# EAGLE design MotorController (EAGLE 9.6.2)

## Sheet 1 of 3
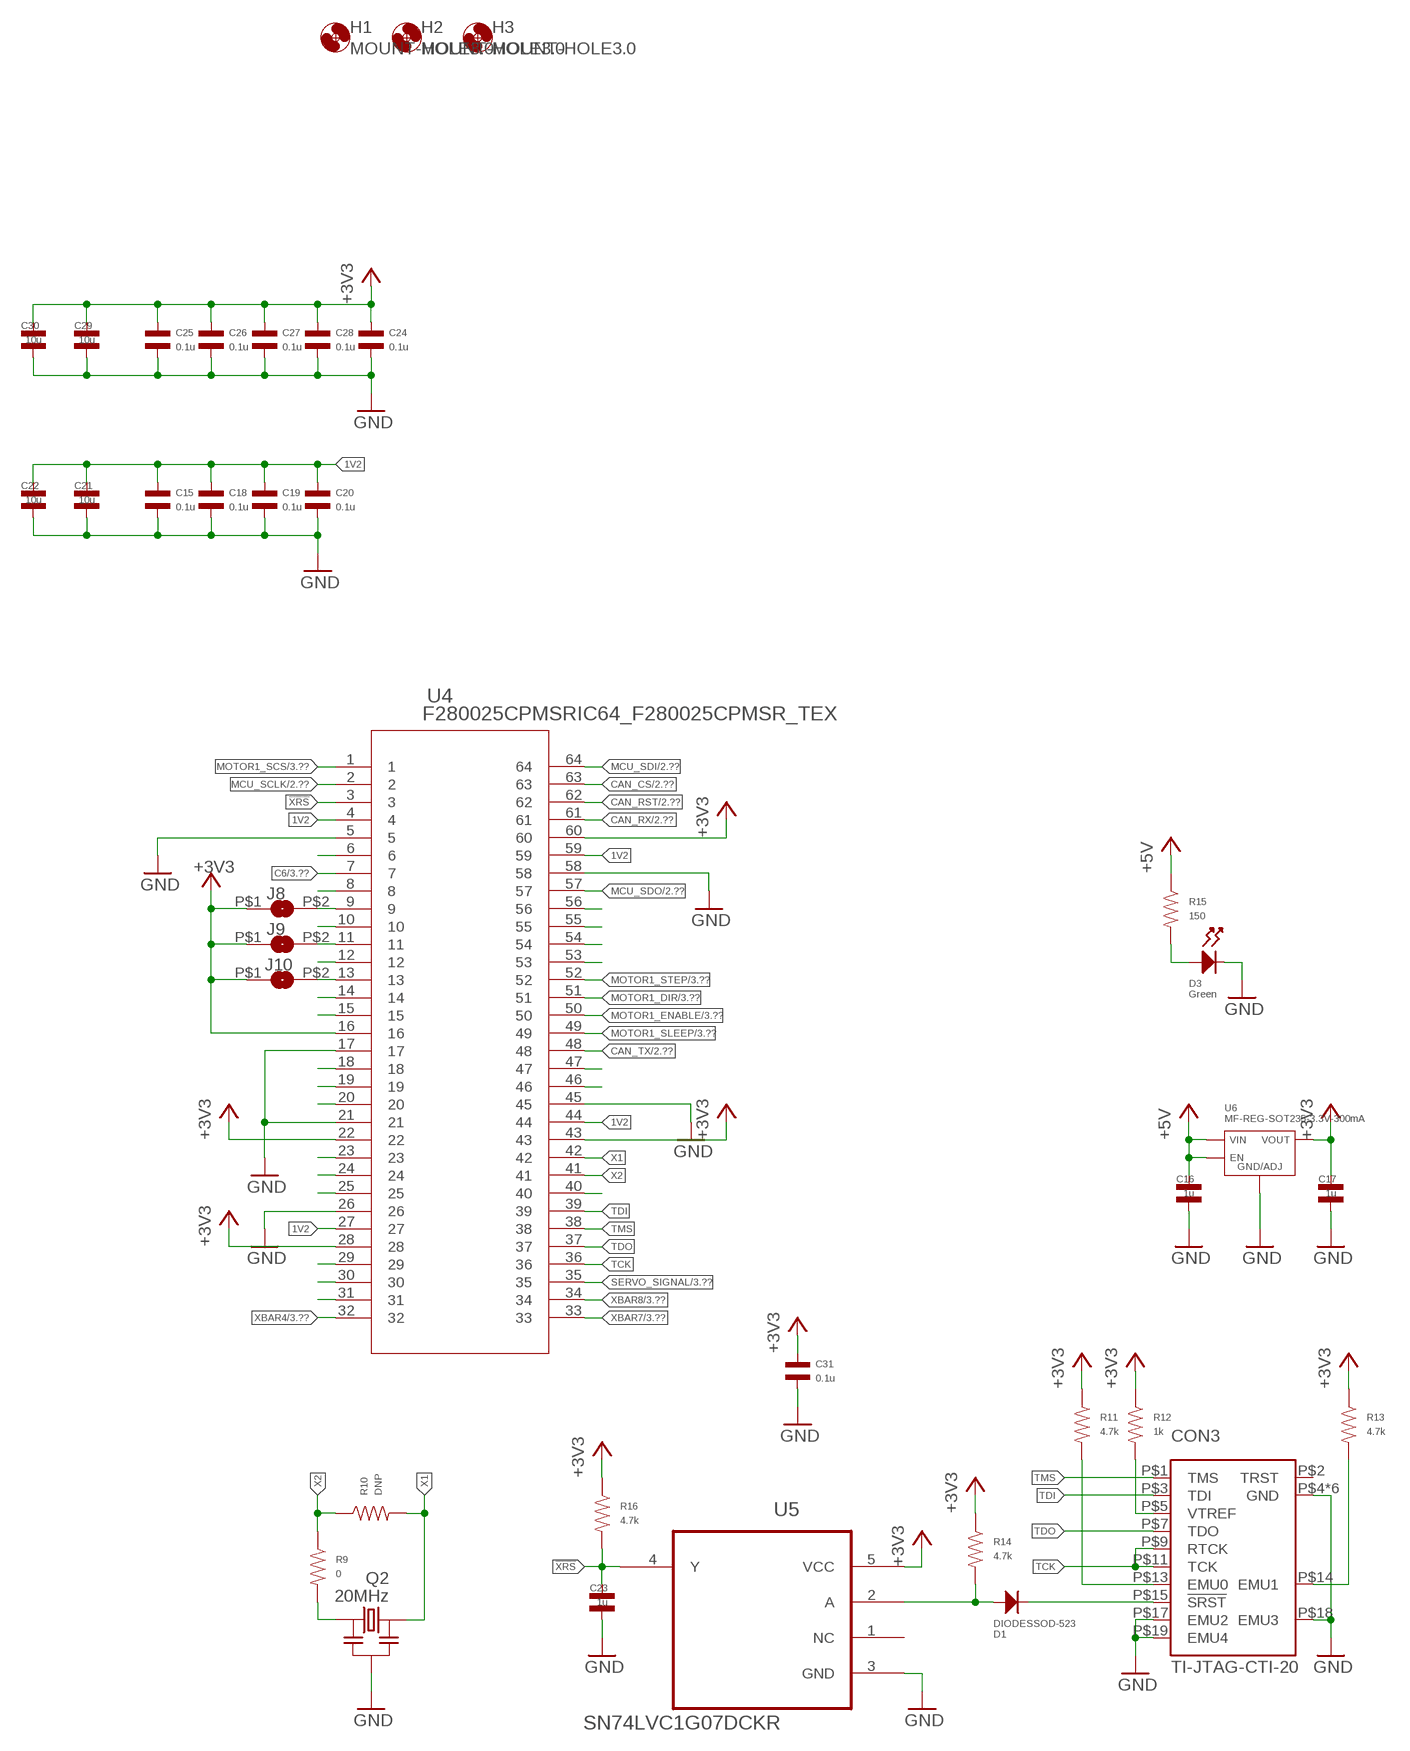
[diagram p0: schematic, sheet 1]

### Parts
C15  0.1u  CAPACITOR_NP_0402  [C0402]
C16  1u  CAPACITOR_NP_0805  [C0805]
C17  1u  CAPACITOR_NP_0805  [C0805]
C18  0.1u  CAPACITOR_NP_0402  [C0402]
C19  0.1u  CAPACITOR_NP_0402  [C0402]
C20  0.1u  CAPACITOR_NP_0402  [C0402]
C21  10u  CAPACITOR_NP_0805  [C0805]
C22  10u  CAPACITOR_NP_0805  [C0805]
C23  1u  CAPACITOR_NP_0402  [C0402]
C24  0.1u  CAPACITOR_NP_0402  [C0402]
C25  0.1u  CAPACITOR_NP_0402  [C0402]
C26  0.1u  CAPACITOR_NP_0402  [C0402]
C27  0.1u  CAPACITOR_NP_0402  [C0402]
C28  0.1u  CAPACITOR_NP_0402  [C0402]
C29  10u  CAPACITOR_NP_0805  [C0805]
C30  10u  CAPACITOR_NP_0805  [C0805]
C31  0.1u  CAPACITOR_NP_0402  [C0402]
CON3  TI-JTAG-CTI-20  [FTR-110-51-L-D-06]
D1  DIODESSOD-523  [SOD523]
D3  Green  LED_SINGLE-0603  [LED0603]
H1  MOUNT-HOLE3.0  [3,0]
H2  MOUNT-HOLE3.0  [3,0]
H3  MOUNT-HOLE3.0  [3,0]
J8  JUMPER  [SJ]
J9  JUMPER  [SJ]
J10  JUMPER  [SJ]
Q2  20MHz  RESONATORCSTNE  [CSTNE]
R9  0  RESISTOR_0402  [R0402]
R10  DNP  RESISTOR_0402  [R0402]
R11  4.7k  RESISTOR_0402  [R0402]
R12  1k  RESISTOR_0402  [R0402]
R13  4.7k  RESISTOR_0402  [R0402]
R14  4.7k  RESISTOR_0402  [R0402]
R15  150  RESISTOR_0805  [R0805]
R16  4.7k  RESISTOR_0402  [R0402]
U4  F280025CPMSRIC64_F280025CPMSR_TEX  [IC64_F280025CPMSR_TEX]
U5  SN74LVC1G07DCKR  [SOT65P210X110-5N]
U6  MF-REG-SOT235-3.3V-300mA  TLV70233PDBVR  [SOT-23-5]

### Nets
1V2: C15.P$1 C18.P$1 C19.P$1 C20.P$1 C21.P$1 C22.P$1 U4.4 U4.27 U4.44 U4.59
!XRS: C23.P$1 R16.P$2 U4.3 U5.4(Y)
+3V3: C17.P$1 C24.P$1 C25.P$1 C26.P$1 C27.P$1 C28.P$1 C29.P$1 C30.P$1 C31.P$1 J8.P$1 J9.P$1 J10.P$1 R11.P$1 R12.P$1 R13.P$1 R14.P$1 R16.P$1 U4.16 U4.22 U4.28 U4.43 U4.60 U5.5(VCC) U6.P$5(VOUT) ; also sheet 2,3
+5V: C16.P$1 R15.P$1 U6.P$1(VIN) U6.P$3(EN) ; also sheet 2,3
C6: U4.7 ; also sheet 3
CAN_CS: U4.63 ; also sheet 2
CAN_RST: U4.62 ; also sheet 2
CAN_RX: U4.61 ; also sheet 2
CAN_TX: U4.48 ; also sheet 2
GND: C15.P$2 C16.P$2 C17.P$2 C18.P$2 C19.P$2 C20.P$2 C21.P$2 C22.P$2 C23.P$2 C24.P$2 C25.P$2 C26.P$2 C27.P$2 C28.P$2 C29.P$2 C30.P$2 C31.P$2 CON3.P$4(GND) CON3.P$8(GND) CON3.P$10(GND) CON3.P$12(GND) CON3.P$16(GND) CON3.P$17(EMU2) CON3.P$18(EMU3) CON3.P$19(EMU4) CON3.P$20(GND) D3.CATHODE Q2.2(GND) U4.5 U4.17 U4.21 U4.26 U4.45 U4.58 U5.3(GND) U6.P$2(GND/ADJ) ; also sheet 2,3
MCU_SCLK: U4.2 ; also sheet 2,3
MCU_SDI: U4.64 ; also sheet 2,3
MCU_SDO: U4.57 ; also sheet 2,3
MOTOR1_DIR: U4.51 ; also sheet 3
MOTOR1_ENABLE: U4.50 ; also sheet 3
MOTOR1_SCS: U4.1 ; also sheet 3
MOTOR1_SLEEP: U4.49 ; also sheet 3
MOTOR1_STEP: U4.52 ; also sheet 3
N$1: D3.ANODE R15.P$2
N$2: U4.18
N$3: U4.19
N$5: CON3.P$5(VTREF) R12.P$2
N$6: Q2.3(XOUT) R9.P$2
N$7: U4.23
N$8: U4.24
N$9: U4.25
N$10: CON3.P$13(EMU0) R11.P$2
N$11: CON3.P$14(EMU1) R13.P$2
N$12: CON3.P$15(!SRST) D1.C(CATHODE)
N$13: U4.29
N$14: U4.30
N$15: U4.31
N$22: U4.20
N$24: U4.40
N$25: D1.A(ANODE) R14.P$2 U5.2(A)
N$26: U4.53
N$27: J8.P$2 U4.9
N$29: U4.10
N$30: U4.46
N$31: U4.47
N$32: J9.P$2 U4.11
N$33: U4.12
N$34: J10.P$2 U4.13
N$35: U4.14
N$36: U4.15
N$38: U4.6
N$40: U4.8
N$54: U4.54
N$55: U4.55
N$56: U4.56
SERVO_SIGNAL: U4.35 ; also sheet 3
TCK: CON3.P$9(RTCK) CON3.P$11(TCK) U4.36
TDI: CON3.P$3(TDI) U4.39
TDO: CON3.P$7(TDO) U4.37
TMS: CON3.P$1(TMS) U4.38
X1: Q2.1(XIN) R10.P$2 U4.42
X2: R9.P$1 R10.P$1 U4.41
XBAR4: U4.32 ; also sheet 3
XBAR7: U4.33 ; also sheet 3
XBAR8: U4.34 ; also sheet 3
Unconnected: CON3.P$2(TRST) U5.1(NC)

## Sheet 2 of 3
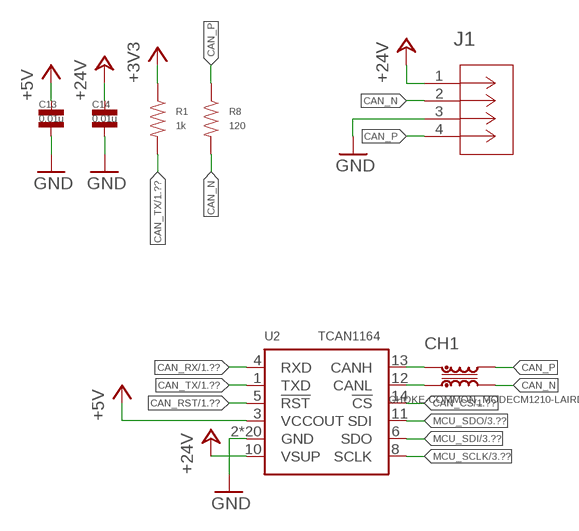
[diagram p1: schematic, sheet 2]

### Parts
C13  0.01u  CAPACITOR_NP_0402  [C0402]
C14  0.01u  CAPACITOR_NP_0402  [C0402]
CH1  CHOKE-COMMON_MODECM1210-LAIRD  [CM1210-LAIRD]
J1  768250004CON_768250004_MOL  [CON_768250004_MOL]
R1  1k  RESISTOR_0402  [R0402]
R8  120  RESISTOR_0402  [R0402]
U2  TCAN1164  [CONV_TPS63021DSJ]

### Nets
+3V3: R1.P$1 ; also sheet 1,3
+5V: C13.P$1 U2.3(VCCOUT) ; also sheet 1,3
+24V: C14.P$1 J1.1 U2.10(VSUP) ; also sheet 3
CAN_CS: U2.14(!CS) ; also sheet 1
CAN_N: CH1.P$3 J1.2 R8.P$2
CAN_P: CH1.P$2 J1.4 R8.P$1
CAN_RST: U2.5(!RST) ; also sheet 1
CAN_RX: U2.4(RXD) ; also sheet 1
CAN_TX: R1.P$2 U2.1(TXD) ; also sheet 1
GND: C13.P$2 C14.P$2 J1.3 U2.2(GND) U2.15(GND) U2.15_1(GND) U2.15_2(GND) U2.15_3(GND) U2.15_4(GND) U2.15_5(GND) U2.15_6(GND) U2.15_7(GND) U2.15_8(GND) U2.15_9(GND) U2.15_10(GND) U2.15_11(GND) U2.15_12(GND) U2.15_15(GND) U2.15_16(GND) U2.15_17(GND) U2.15_21(GND) U2.15_22(GND) U2.15_23(GND) ; also sheet 1,3
MCU_SCLK: U2.8(SCLK) ; also sheet 1,3
MCU_SDI: U2.6(SDO) ; also sheet 1,3
MCU_SDO: U2.11(SDI) ; also sheet 1,3
N$4: CH1.P$4 U2.12(CANL)
N$17: CH1.P$1 U2.13(CANH)

## Sheet 3 of 3
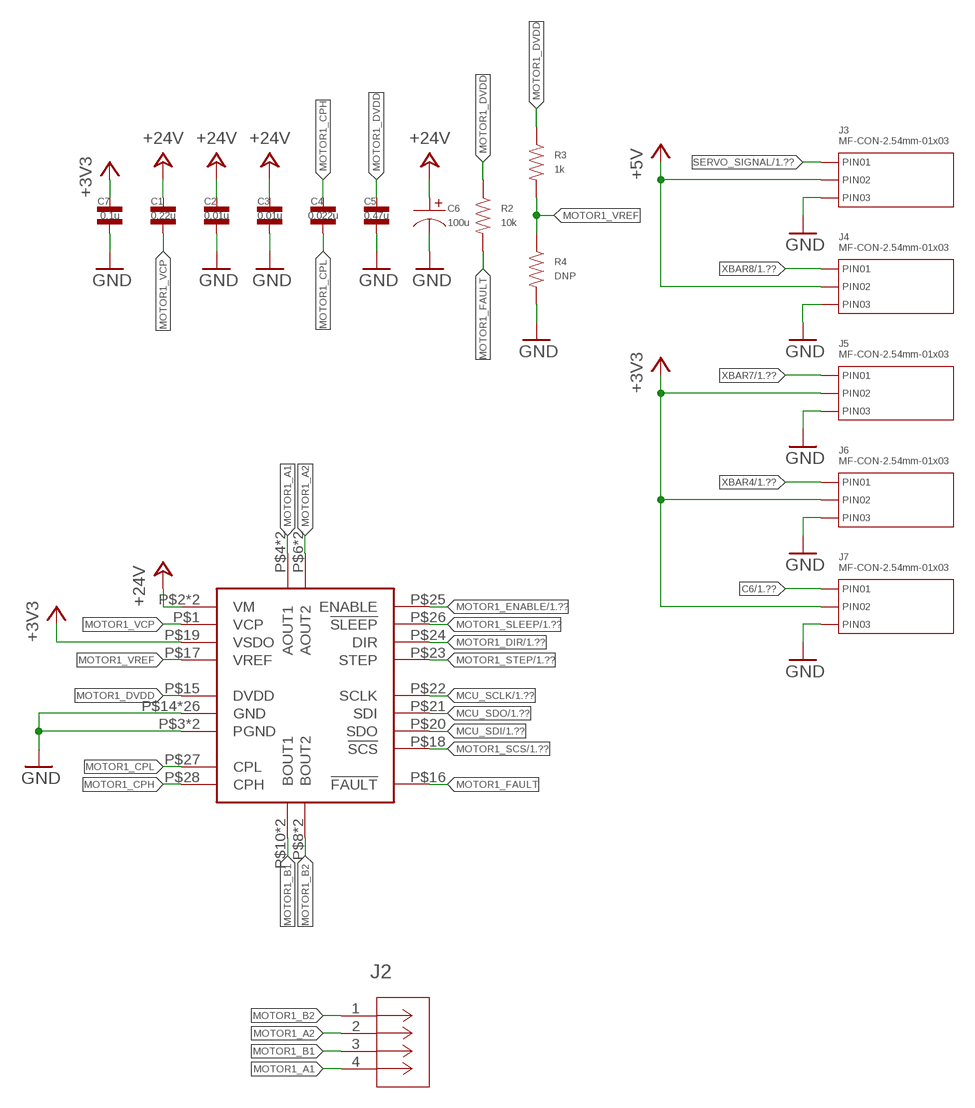
[diagram p2: schematic, sheet 3]

### Parts
C1  0.22u  CAPACITOR_NP_0402  [C0402]
C2  0.01u  CAPACITOR_NP_0402  [C0402]
C3  0.01u  CAPACITOR_NP_0402  [C0402]
C4  0.022u  CAPACITOR_NP_0402  [C0402]
C5  0.47u  CAPACITOR_NP_0402  [C0402]
C6  100u  CAPACITOR_P_6.3MM  [CP6.3MM]
C7  0.1u  CAPACITOR_NP_0402  [C0402]
J2  768250004CON_768250004_MOL  [CON_768250004_MOL]
J3  MF-CON-2.54mm-01x03  CON_01X03_PTH_2.54MM  [PTH_2.54MM_01X03]
J4  MF-CON-2.54mm-01x03  CON_01X03_PTH_2.54MM  [PTH_2.54MM_01X03]
J5  MF-CON-2.54mm-01x03  CON_01X03_PTH_2.54MM  [PTH_2.54MM_01X03]
J6  MF-CON-2.54mm-01x03  CON_01X03_PTH_2.54MM  [PTH_2.54MM_01X03]
J7  MF-CON-2.54mm-01x03  CON_01X03_PTH_2.54MM  [PTH_2.54MM_01X03]
R2  10k  RESISTOR_0402  [R0402]
R3  1k  RESISTOR_0402  [R0402]
R4  DNP  RESISTOR_0402  [R0402]
U1  DRV8434SPWPR  [HTSSOP(PWP)-28]

### Nets
+3V3: C7.P$1 J5.P$2(PIN2) J6.P$2(PIN2) J7.P$2(PIN2) U1.P$19(VSDO) ; also sheet 1,2
+5V: J3.P$2(PIN2) J4.P$2(PIN2) ; also sheet 1,2
+24V: C1.P$1 C2.P$1 C3.P$1 C6.P$1 U1.P$2(VM) U1.P$13(VM) ; also sheet 2
C6: J7.P$1(PIN1) ; also sheet 1
GND: C2.P$2 C3.P$2 C5.P$2 C6.P$2 C7.P$2 J3.P$3(PIN3) J4.P$3(PIN3) J5.P$3(PIN3) J6.P$3(PIN3) J7.P$3(PIN3) R4.P$2 U1.P$3(PGND) U1.P$12(PGND) U1.P$14(GND) U1.P$29(GND) U1.P$30(GND) U1.P$31(GND) U1.P$32(GND) U1.P$33(GND) U1.P$34(GND) U1.P$35(GND) U1.P$36(GND) U1.P$37(GND) U1.P$38(GND) U1.P$39(GND) U1.P$40(GND) U1.P$41(GND) U1.P$42(GND) U1.P$43(GND) U1.P$44(GND) U1.P$45(GND) U1.P$46(GND) U1.P$47(GND) U1.P$48(GND) U1.P$49(GND) U1.P$50(GND) U1.P$51(GND) U1.P$52(GND) U1.P$53(GND) ; also sheet 1,2
MCU_SCLK: U1.P$22(SCLK) ; also sheet 1,2
MCU_SDI: U1.P$20(SDO) ; also sheet 1,2
MCU_SDO: U1.P$21(SDI) ; also sheet 1,2
MOTOR1_A1: J2.4 U1.P$4(AOUT1) U1.P$5(AOUT1)
MOTOR1_A2: J2.2 U1.P$6(AOUT2) U1.P$7(AOUT2)
MOTOR1_B1: J2.3 U1.P$10(BOUT1) U1.P$11(BOUT1)
MOTOR1_B2: J2.1 U1.P$8(BOUT2) U1.P$9(BOUT2)
MOTOR1_CPH: C4.P$1 U1.P$28(CPH)
MOTOR1_CPL: C4.P$2 U1.P$27(CPL)
MOTOR1_DIR: U1.P$24(DIR) ; also sheet 1
MOTOR1_DVDD: C5.P$1 R2.P$1 R3.P$1 U1.P$15(DVDD)
MOTOR1_ENABLE: U1.P$25(ENABLE) ; also sheet 1
MOTOR1_FAULT: R2.P$2 U1.P$16(!FAULT)
MOTOR1_SCS: U1.P$18(!SCS) ; also sheet 1
MOTOR1_SLEEP: U1.P$26(!SLEEP) ; also sheet 1
MOTOR1_STEP: U1.P$23(STEP) ; also sheet 1
MOTOR1_VCP: C1.P$2 U1.P$1(VCP)
MOTOR1_VREF: R3.P$2 R4.P$1 U1.P$17(VREF)
SERVO_SIGNAL: J3.P$1(PIN1) ; also sheet 1
XBAR4: J6.P$1(PIN1) ; also sheet 1
XBAR7: J5.P$1(PIN1) ; also sheet 1
XBAR8: J4.P$1(PIN1) ; also sheet 1

## Library data of the parts
C1 = MF_Passives:CAPACITOR_NP: Library: MF_Passives Description: Device for Non-Polarized Capacitors. Manufacture part number (MPN) can be added via Attributes. Check https://factory.macrofab.com/parts for the house parts list.; MPN: CL05B224KA5VPNC; POPULATE: 1
C2 C3 C13 C14 = MF_Passives:CAPACITOR_NP: Library: MF_Passives Description: Device for Non-Polarized Capacitors. Manufacture part number (MPN) can be added via Attributes. Check https://factory.macrofab.com/parts for the house parts list.; MPN: CL05B103KB5NNNC; POPULATE: 1
C4 = MF_Passives:CAPACITOR_NP: Library: MF_Passives Description: Device for Non-Polarized Capacitors. Manufacture part number (MPN) can be added via Attributes. Check https://factory.macrofab.com/parts for the house parts list.; MPN: CL05B223KB5VPNC; POPULATE: 1
C5 = MF_Passives:CAPACITOR_NP: Library: MF_Passives Description: Device for Non-Polarized Capacitors. Manufacture part number (MPN) can be added via Attributes. Check https://factory.macrofab.com/parts for the house parts list.; MPN: CL05A474KA5NNNC; POPULATE: 1
C6 = MF_Passives:CAPACITOR_P: Library: MF_Passives Description: Device for Polarized Capacitors. Manufacture part number (MPN), Voltage Rating, and Tolerance can be added via Attributes. Check https://factory.macrofab.com/parts for the house parts list.; MPN: MAL218297603E3; POPULATE: 1
C7 C15 C18-C20 C24-C28 C31 = MF_Passives:CAPACITOR_NP: Library: MF_Passives Description: Device for Non-Polarized Capacitors. Manufacture part number (MPN) can be added via Attributes. Check https://factory.macrofab.com/parts for the house parts list.; MPN: GCM155R71H104KE02D; POPULATE: 1
C16 C17 = MF_Passives:CAPACITOR_NP: Library: MF_Passives Description: Device for Non-Polarized Capacitors. Manufacture part number (MPN) can be added via Attributes. Check https://factory.macrofab.com/parts for the house parts list.; MPN: CL21B105KAFNNNE; POPULATE: 1
C21 C22 C29 C30 = MF_Passives:CAPACITOR_NP: Library: MF_Passives Description: Device for Non-Polarized Capacitors. Manufacture part number (MPN) can be added via Attributes. Check https://factory.macrofab.com/parts for the house parts list.; MPN: CL21A106KAYNNNE; POPULATE: 1
C23 = MF_Passives:CAPACITOR_NP: Library: MF_Passives Description: Device for Non-Polarized Capacitors. Manufacture part number (MPN) can be added via Attributes. Check https://factory.macrofab.com/parts for the house parts list.; MPN: CL05A105KA5NQNC; POPULATE: 1
CH1 = vehicle-control:CHOKE-COMMON_MODE; MPN: CM1210B104R-1A
CON3 = vehicle-control:TI-JTAG-CTI-20; MPN: FTR-110-51-L-D-06
D1 = MF_Discrete_Semiconductor:DIODES: Library: MF_Discrete_Semiconductor Description: Device for Single Packaged Diodes.; MPN: RB510SM-40FHT2R
D3 = MF_LEDs:LED_SINGLE: Library: MF_LEDs Description: Device for Single LED Packages. Manufacture part number (MFG#) can be added via Attributes.; HOUSEPART: NO; MPN: SML-E12P8WT86; POPULATE: 1
H1-H3 = holes:MOUNT-HOLE: MOUNTING HOLE with drill center marker
J1 J2 = Molex0768250004:768250004; COPYRIGHT: Copyright (C) 2024 Ultra Librarian. All rights reserved.; MANUFACTURER_PART_NUMBER: 768250004; MFR_NAME: Molex Connector Corporation; MPN: 0768250004
J3-J7 = MF_Connectors:CON_01X03: Library: MF_Connectors Description: Header Connector with 03 Positions and 01 Rows. Use the LABEL Attribute to label the pin on the schematic and PCB. You can remove the attributes on the PCB by using the SMASH function on the part and then deleting the text.; HOUSEPART: YES; MPN: MF-CON-2.54mm-01x03; POPULATE: 1; URL: https://factory.macrofab.com/part/MF-CON-2.54mm-01x03
J8-J10 = MF_Connectors:JUMPER
Q2 = vehicle-control:RESONATOR; MPN: CSTNE20M0V53C000R0
R1 R3 R12 = MF_Passives:RESISTOR: Library: MF_Passives Description: Device for Resistors. Manufacture part number (MPN), Voltage, Tolerance, and Wattage Rating can be added via Attributes. Check https://factory.macrofab.com/parts for the house parts list.; MPN: ERJ-2RKF1001X; POPULATE: 1
R2 = MF_Passives:RESISTOR: Library: MF_Passives Description: Device for Resistors. Manufacture part number (MPN), Voltage, Tolerance, and Wattage Rating can be added via Attributes. Check https://factory.macrofab.com/parts for the house parts list.; MPN: ERJ-2RKF1002X; POPULATE: 1
R4 R10 = MF_Passives:RESISTOR: Library: MF_Passives Description: Device for Resistors. Manufacture part number (MPN), Voltage, Tolerance, and Wattage Rating can be added via Attributes. Check https://factory.macrofab.com/parts for the house parts list.; POPULATE: 1
R8 = MF_Passives:RESISTOR: Library: MF_Passives Description: Device for Resistors. Manufacture part number (MPN), Voltage, Tolerance, and Wattage Rating can be added via Attributes. Check https://factory.macrofab.com/parts for the house parts list.; MPN: ERJ-2GEJ121X; POPULATE: 1
R9 = MF_Passives:RESISTOR: Library: MF_Passives Description: Device for Resistors. Manufacture part number (MPN), Voltage, Tolerance, and Wattage Rating can be added via Attributes. Check https://factory.macrofab.com/parts for the house parts list.; MPN: ERJ-2GE0R00X; POPULATE: 1
R11 R13 R14 R16 = MF_Passives:RESISTOR: Library: MF_Passives Description: Device for Resistors. Manufacture part number (MPN), Voltage, Tolerance, and Wattage Rating can be added via Attributes. Check https://factory.macrofab.com/parts for the house parts list.; MPN: ERJ-2RKF4701X; POPULATE: 1
R15 = MF_Passives:RESISTOR: Library: MF_Passives Description: Device for Resistors. Manufacture part number (MPN), Voltage, Tolerance, and Wattage Rating can be added via Attributes. Check https://factory.macrofab.com/parts for the house parts list.; MPN: ERJ-6GEYJ151V; POPULATE: 1
U1 = TI DRV:DRV8434SPWPR; MPN: DRV8434SPWPR
U2 = TCAN1043GDMTRQ1:TCAN1164; MPN: TCAN1164DMTRQ1
U4 = F280025CPMSR:F280025CPMSR; COPYRIGHT: Copyright (C) 2024 Ultra Librarian. All rights reserved.; MANUFACTURER_PART_NUMBER: F280025CPMSR; MFR_NAME: Texas Instruments; MPN: F280025CPMSR
U5 = Texas Instruments_By_element14_Batch_1:SN74LVC1G07DCKR: SINGLE BUFFER/DRIVER WITH OPEN-DRAIN OUTPUT; MPN: SN74LVC1G07DCKR; OC_FARNELL: 1287544; OC_NEWARK: 76C4075; PACKAGE: SC70-5; SUPPLIER: Texas Instruments
U6 = MF_IC_Power:TLV702: Manufacturer Part #: TLV702 Manufacturer: Texas Instruments Description: LDO Voltage Regulators; HOUSEPART: YES; MPN: TLV70233PDBVR; POPULATE: 1; URL: https://factory.macrofab.com/part/MF-REG-SOT235-3.3V-300mA

## Board
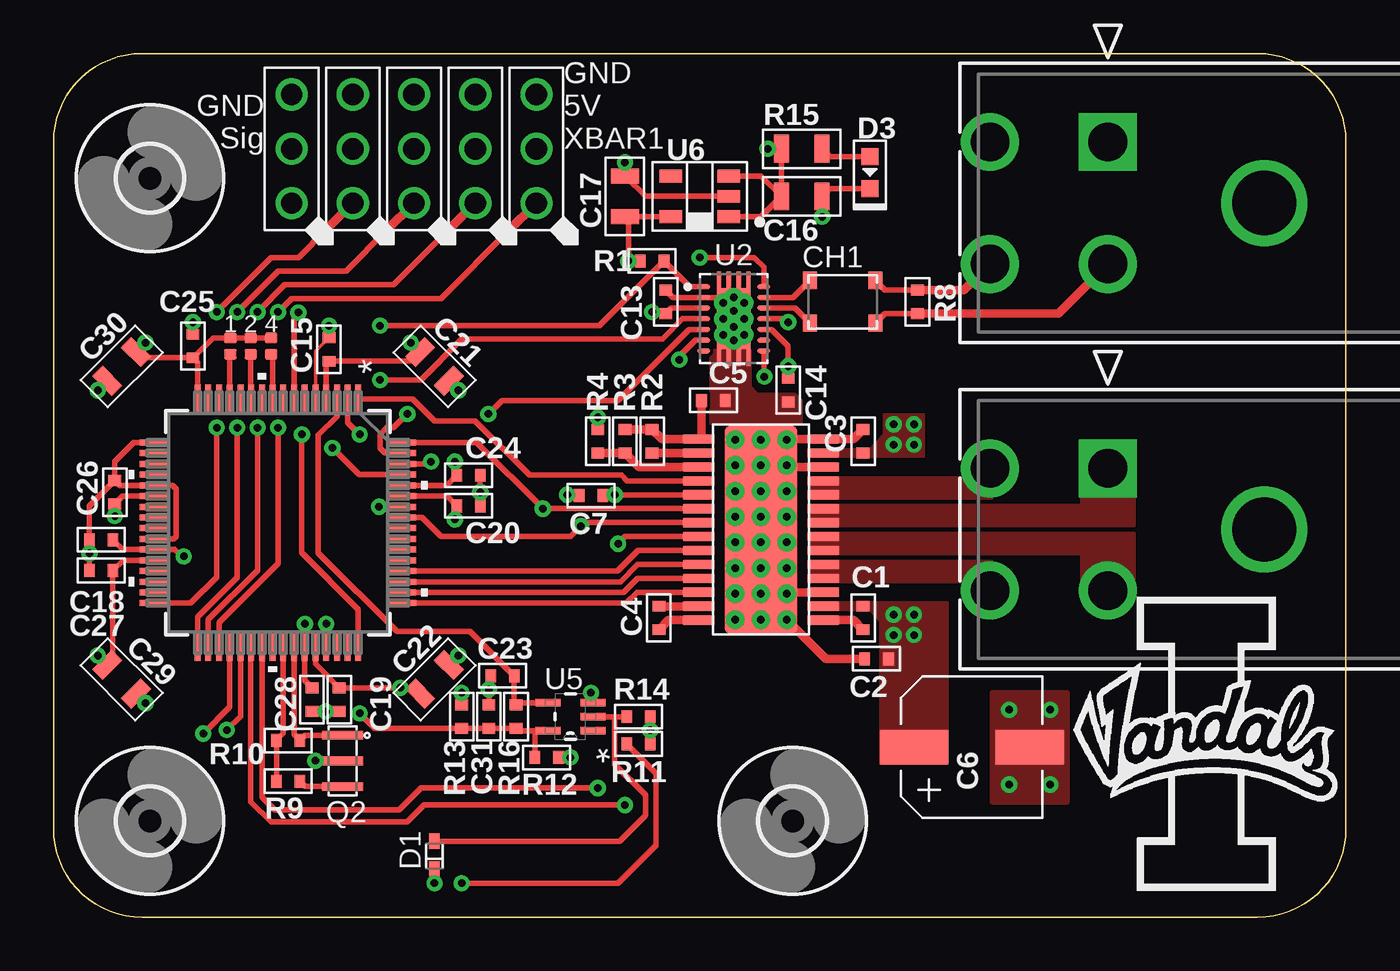
[diagram p3: board, top side]
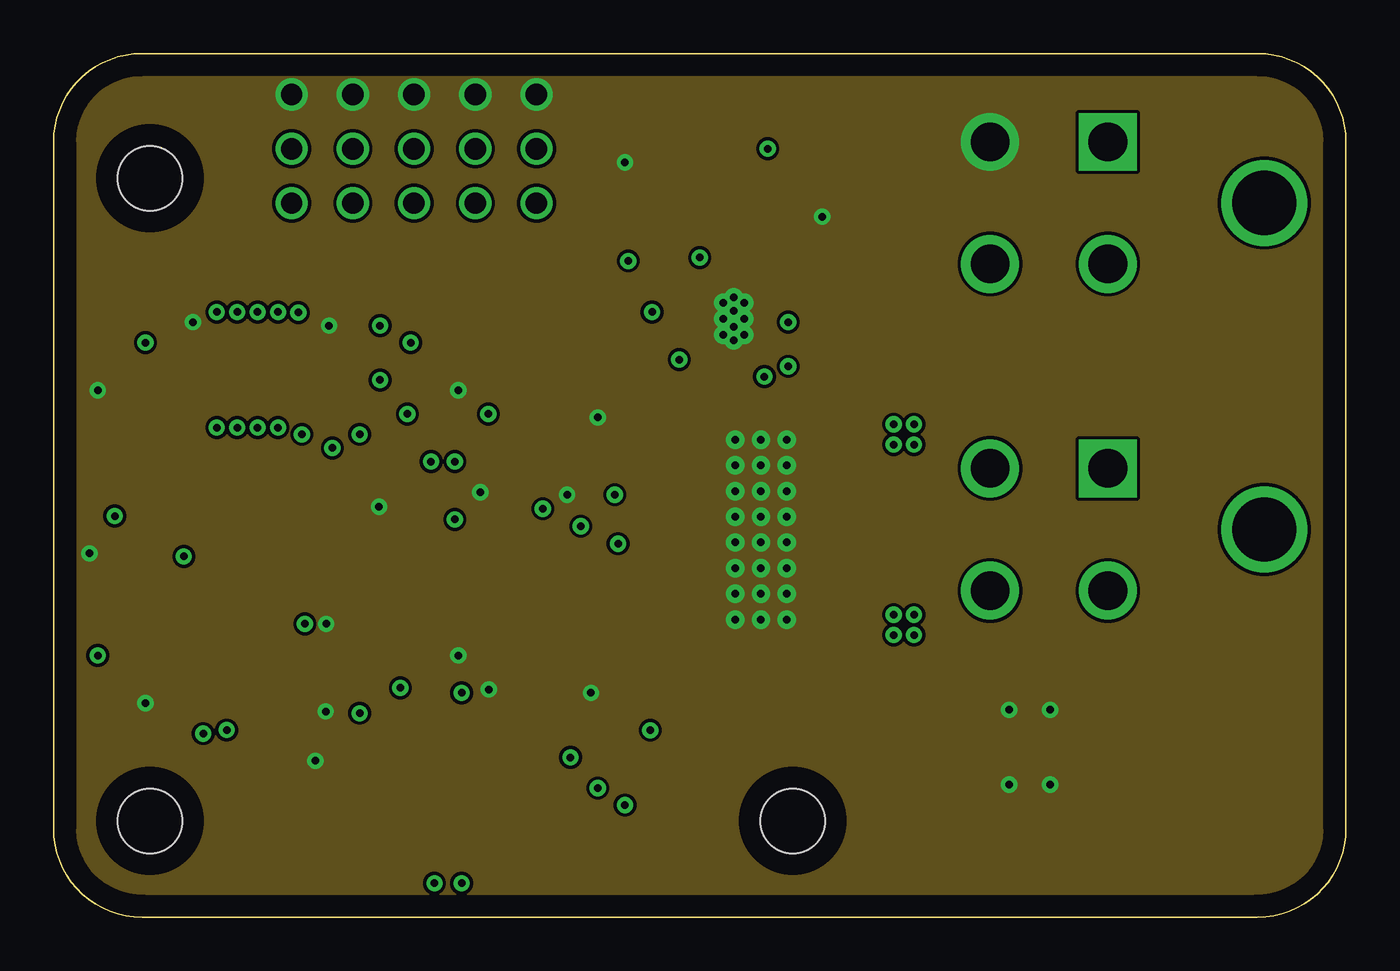
[diagram p4: board, inner layer GND]
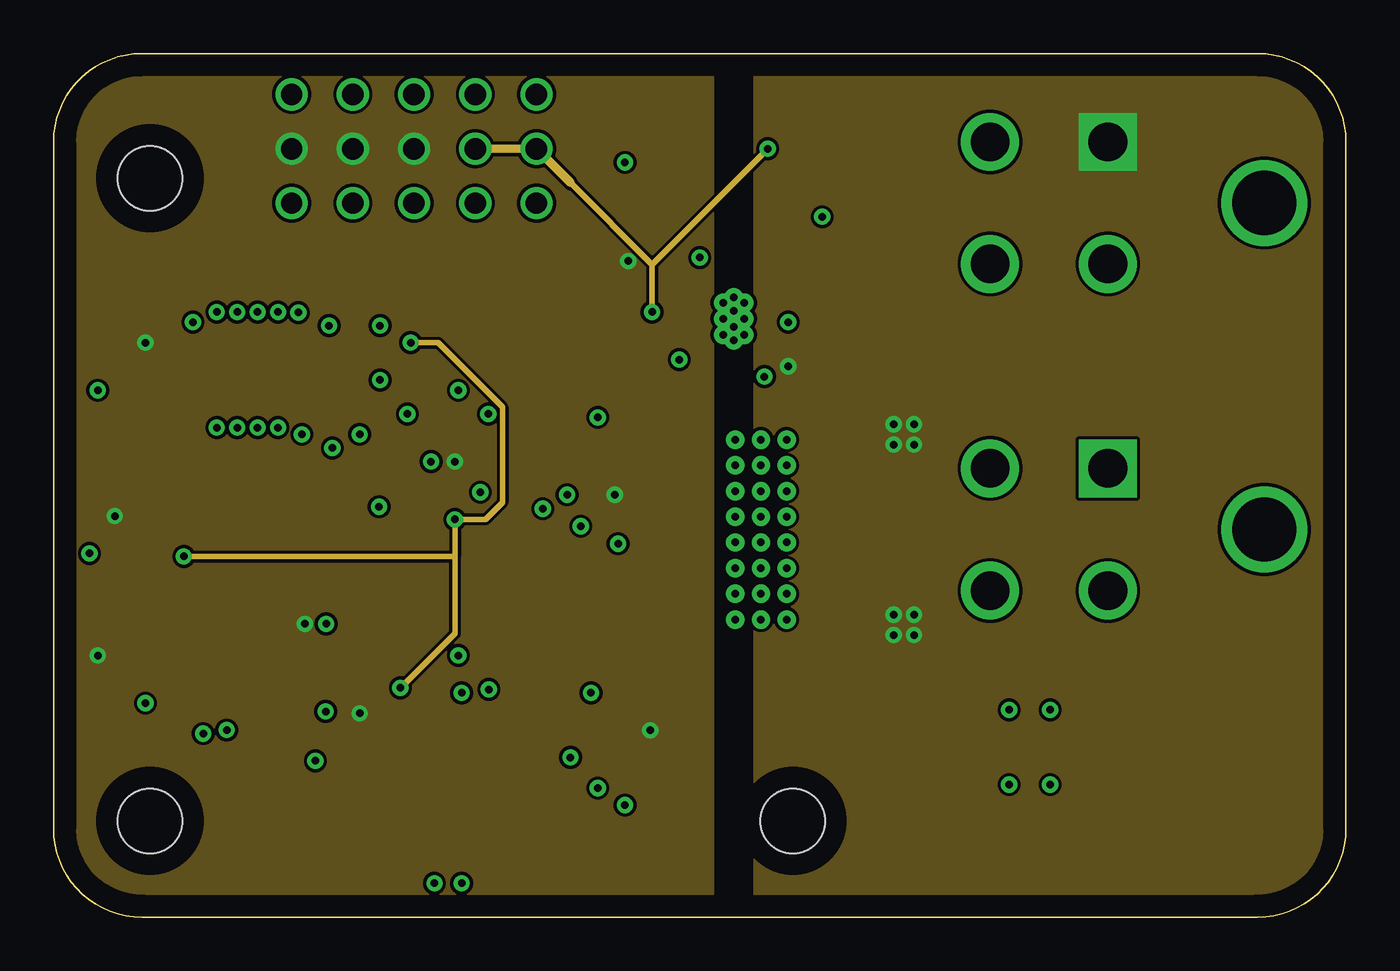
[diagram p5: board, inner layer PWR]
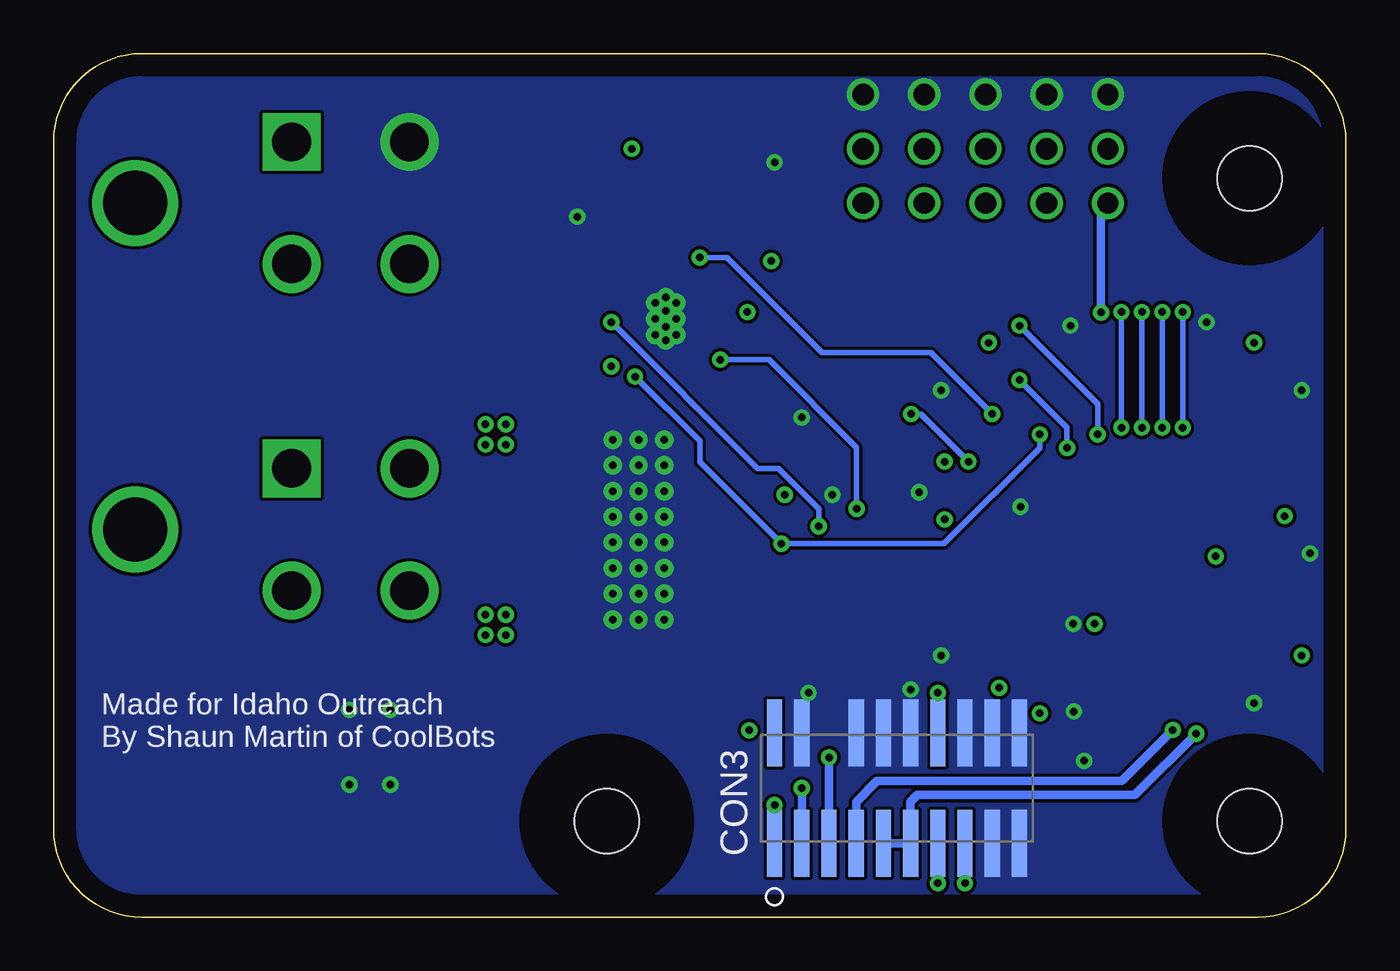
[diagram p6: board, bottom side, seen from below]

Size 60.33 x 40.32 mm. Coordinates in mm from the lower left corner, seen from the top.
Outline: 4.13,0 arc-90 0,4.13 0,36.2 arc-90 4.13,40.32 56.2,40.32 arc-90 60.33,36.2 60.33,4.13 arc-90 56.2,0 4.13,0
Copper layers (1+2*15+16): Top 0.035mm / dielectric 0.35mm / GND 0.035mm / dielectric 0.35mm / PWR 0.035mm / dielectric 0.35mm / Bottom 0.035mm
Design rules "default *": minimum track width 6mil, minimum drill 0.35mm, track to track 6mil, track to pad 6mil, pad to pad 6mil, via to via 6mil, smd to smd 6mil, copper to edge 40mil, drill to drill 6mil, minimum pad ring 10mil, minimum via ring 8mil, stop-mask expansion 4mil, vias tented up to drill 0mil, thermal gap 10mil

### Footprints (pad centres in the part's own frame; a part is rotated, then mirrored left to right if it is on the bottom)
C0402 = smd 0.5 x 0.6: P$1 -0.55,0; P$2 0.55,0
CP6.3MM = smd 1.6 x 3.2: P$1 0,-2.7; P$2 0,2.7
C0805 = smd 0.7 x 1.3: P$1 -0.95,0; P$2 0.95,0
CM1210-LAIRD = smd 0.65 x 0.8: P$1 -1.525,1; P$2 1.525,1; P$3 1.525,-1; P$4 -1.525,-1
FTR-110-51-L-D-06 = smd 0.711 x 3.124: P$1 -5.715,-2.578; P$2 -5.715,2.578; P$3 -4.445,-2.578; P$4 -4.445,2.578; P$5 -3.175,-2.578; P$7 -1.905,-2.578; P$8 -1.905,2.578; P$9 -0.635,-2.578; P$10 -0.635,2.578; P$11 0.635,-2.578; P$12 0.635,2.578; P$13 1.905,-2.578; P$14 1.905,2.578; P$15 3.175,-2.578; P$16 3.175,2.578; P$17 4.445,-2.578; P$18 4.445,2.578; P$19 5.715,-2.578; P$20 5.715,2.578
SOD523 = smd 0.7 x 0.5: A 0.7,0; C -0.6,0
LED0603 = smd 0.8 x 0.8: ANODE 0.75,0; CATHODE -0.75,0
3,0 = hole 3: 0,0
CON_768250004_MOL = drill 1.8 pad 2.3 square: 1 0,0 | drill 1.8 pad 2.3: 2 -5.7,0; 3 0,5.5; 4 -5.7,5.5 | drill 3 pad 3: 5 -2.85,-7.3
PTH_2.54MM_01X03 = drill 1: P$1 -2.54,0; P$2 0,0; P$3 2.54,0
SJ = smd 0.5 x 0.6: P$1 -0.381,0; P$2 0.381,0
CSTNE = smd 0.4 x 1.9: 1 -1.2,0; 2 0,0; 3 1.2,0
R0402 = smd 0.5 x 0.6: P$1 -0.55,0; P$2 0.55,0
R0805 = smd 0.7 x 1.3: P$1 -0.95,0; P$2 0.95,0
HTSSOP(PWP)-28 = smd 1.5 x 0.45: P$1 -2.9,4.225; P$2 -2.9,3.575; P$3 -2.9,2.925; P$4 -2.9,2.275; P$5 -2.9,1.625; P$6 -2.9,0.975; P$7 -2.9,0.325; P$8 -2.9,-0.325; P$9 -2.9,-0.975; P$10 -2.9,-1.625; P$11 -2.9,-2.275; P$12 -2.9,-2.925; P$13 -2.9,-3.575; P$14 -2.9,-4.225; P$15 2.9,-4.225; P$16 2.9,-3.575; P$17 2.9,-2.925; P$18 2.9,-2.275; P$19 2.9,-1.625; P$20 2.9,-0.975; P$21 2.9,-0.325; P$22 2.9,0.325; P$23 2.9,0.975; P$24 2.9,1.625; P$25 2.9,2.275; P$26 2.9,2.925; P$27 2.9,3.575; P$28 2.9,4.225 | smd 3.4 x 9.7: P$29 0,0 | drill 0.35 pad 0.406: P$30 -1.2,4.2; P$31 0,4.2; P$32 1.2,4.2; P$33 -1.2,3; P$34 0,3; P$35 1.2,3; P$36 -1.2,1.8; P$37 0,1.8; P$38 1.2,1.8; P$39 -1.2,0.6; P$40 0,0.6; P$41 1.2,0.6; P$42 -1.2,-0.6; P$43 0,-0.6; P$44 1.2,-0.6; P$45 -1.2,-1.8; P$46 0,-1.8; P$47 1.2,-1.8; P$48 -1.2,-3; P$49 0,-3; P$50 1.2,-3; P$51 -1.2,-4.2; P$52 0,-4.2; P$53 1.2,-4.2
CONV_TPS63021DSJ = smd 0.6 x 0.24: 1 -1.4,1.5; 2 -1.4,1; 3 -1.4,0.5; 4 -1.4,0; 5 -1.4,-0.5; 6 -1.4,-1; 7 -1.4,-1.5; 8 1.4,-1.5; 9 1.4,-1; 10 1.4,-0.5; 11 1.4,0; 12 1.4,0.5; 13 1.4,1; 14 1.4,1.5 | smd 1.58 x 2.85: 15 0,0 | smd 0.2 x 0.775: 15_1 -0.69,1.812; 15_2 -0.23,1.812; 15_3 0.23,1.812; 15_4 0.69,1.812; 15_5 0.69,-1.812; 15_6 0.23,-1.812; 15_7 -0.23,-1.812; 15_8 -0.69,-1.812 | drill 0.35 pad 0.406: 15_9 -0.5,0.746; 15_10 0,1; 15_11 0.5,0.746; 15_12 -0.5,0; 15_15 0,0.381; 15_16 0,-0.381; 15_17 0.5,0; 15_21 -0.5,-0.746; 15_22 0,-1; 15_23 0.5,-0.746
IC64_F280025CPMSR_TEX = smd 1.35 x 0.279: 1 -5.78,3.75; 2 -5.78,3.25; 3 -5.78,2.75; 4 -5.78,2.25; 5 -5.78,1.75; 6 -5.78,1.25; 7 -5.78,0.75; 8 -5.78,0.25; 9 -5.78,-0.25; 10 -5.78,-0.75; 11 -5.78,-1.25; 12 -5.78,-1.75; 13 -5.78,-2.25; 14 -5.78,-2.75; 15 -5.78,-3.25; 16 -5.78,-3.75; 33 5.78,-3.75; 34 5.78,-3.25; 35 5.78,-2.75; 36 5.78,-2.25; 37 5.78,-1.75; 38 5.78,-1.25; 39 5.78,-0.75; 40 5.78,-0.25; 41 5.78,0.25; 42 5.78,0.75; 43 5.78,1.25; 44 5.78,1.75; 45 5.78,2.25; 46 5.78,2.75; 47 5.78,3.25; 48 5.78,3.75 | smd 0.279 x 1.35: 17 -3.75,-5.78; 18 -3.25,-5.78; 19 -2.75,-5.78; 20 -2.25,-5.78; 21 -1.75,-5.78; 22 -1.25,-5.78; 23 -0.75,-5.78; 24 -0.25,-5.78; 25 0.25,-5.78; 26 0.75,-5.78; 27 1.25,-5.78; 28 1.75,-5.78; 29 2.25,-5.78; 30 2.75,-5.78; 31 3.25,-5.78; 32 3.75,-5.78; 49 3.75,5.78; 50 3.25,5.78; 51 2.75,5.78; 52 2.25,5.78; 53 1.75,5.78; 54 1.25,5.78; 55 0.75,5.78; 56 0.25,5.78; 57 -0.25,5.78; 58 -0.75,5.78; 59 -1.25,5.78; 60 -1.75,5.78; 61 -2.25,5.78; 62 -2.75,5.78; 63 -3.25,5.78; 64 -3.75,5.78
SOT65P210X110-5N = smd 1.168 x 0.356: 1 -1.041,0.66; 2 -1.041,0; 3 -1.041,-0.66; 4 1.041,-0.66; 5 1.041,0.66
SOT-23-5 = smd 1.05 x 0.6: P$1 -1.35,0.95; P$2 -1.35,0; P$3 -1.35,-0.95; P$4 1.35,-0.95; P$5 1.35,0.95

### Placement (x,y rotation side)
C1  37.78,13.97 270 top
C2  38.42,12.06 180 top
C3  37.78,22.23 90 top
C4  28.26,13.97 90 top
C5  30.8,24.13 0 top
C6  42.86,7.94 270 top
C7  25.08,19.68 180 top
C13  28.57,28.73 90 top
C14  34.29,24.61 270 top
C15  12.86,26.51 90 top
C16  34.92,33.66 0 top
C17  26.67,33.66 90 top
C18  2.22,17.62 180 top
C19  13.34,10.16 270 top
C20  19.37,19.21 0 top
C21  17.78,25.72 315 top
C22  17.78,11.11 45 top
C23  20.95,11.27 180 top
C24  19.37,20.64 0 top
C25  6.51,26.67 90 top
C26  2.86,19.84 90 top
C27  2.22,16.19 180 top
C28  12.06,10.16 270 top
C29  3.17,11.11 315 top
C30  3.17,25.72 225 top
C31  20.32,9.37 90 top
CH1  36.83,28.73 0 top
CON3  20.95,6.03 0 bottom
D1  17.78,2.86 90 top
D3  38.1,34.77 90 top
H1  34.5,4.5 0 top
H2  4.5,4.5 0 top
H3  4.5,34.5 0 top
J1  49.21,36.2 90 top
J2  49.21,20.95 90 top
J3  22.54,35.88 90 top
J4  19.68,35.88 90 top
J5  16.83,35.88 90 top
J6  13.97,35.88 90 top
J7  11.11,35.88 90 top
J8  10.16,26.67 270 top
J9  9.21,26.67 270 top
J10  8.26,26.67 270 top
Q2  13.49,7.3 270 top
R1  27.94,30.64 0 top
R2  27.94,22.23 270 top
R3  26.67,22.23 270 top
R4  25.4,22.23 90 top
R8  40.32,28.73 270 top
R9  10.95,6.35 0 top
R10  10.95,8.26 0 top
R11  27.3,8.1 180 top
R12  23.02,7.46 0 top
R13  19.05,9.37 90 top
R14  27.3,9.37 180 top
R15  34.92,35.88 0 top
R16  21.59,9.37 90 top
U1  33.02,18.1 180 top
U2  31.75,27.94 0 top
U4  10.48,18.41 270 top
U5  24.13,9.37 180 top
U6  30.16,33.66 180 top

### Tracks (layer width: path | path; a pad name or v marks a point on that pad's centre or on a via)
1V2  (via drill 0.35)
  Top 0.254: U4.59 18.36,19.66 C20.P$1 18.73,19.12 v18.73,18.57 | U4.4 12.73,26.04 C15.P$1 16.68,25.96 C21.P$1 v16.67,26.83 | C18.P$1 3.23,17.16 U4.27 5.65,17.16 5.97,16.85 v6.08,16.85 | U4.44 12.23,11.82 C19.P$1 v16.19,10.71 16.84,10.71 C22.P$1 | v16.67,26.83
  PWR 0.254: v16.67,26.83 17.94,26.83 20.95,23.81 20.95,19.37 20.16,18.57 v18.73,18.57 18.73,16.85 | v16.19,10.71 18.73,13.25 18.73,16.85 | v6.08,16.85 18.73,16.85
!XRS
  Top 0.254: 21.5,10 C23.P$1 19.44,13.34 16.03,13.34 12.36,17.01 12.36,22.52 13.23,23.39 U4.3 | 21.5,10 R16.P$2 | U5.4 23.06,10 21.5,10
+3V3  (via drill 0.35)
  Top 0.254: U4.60 18.34,20.16 C24.P$1 18.73,20.72 v18.73,21.27 | U1.P$19 v26.21,19.72 v26.2,19.73 26.15,19.68 C7.P$1 | U4.16 6.73,25.9 C25.P$1 | U4.28 3.25,16.66 C27.P$1 2.77,12.05 C29.P$1 | C28.P$1 11.73,11.05 U4.43 v11.73,13.7 | U4.22 3.23,19.66 C26.P$1 v2.86,18.73 | C25.P$1 4.12,26.12 C30.P$1 v4.29,26.83 | C29.P$1 | C29.P$1 v2.06,12.22 | R14.P$1 v27.86,8.73 R11.P$1 | U5.5 22.54,8.71 | 22.54,8.71 21.7,8.71 R16.P$1 C31.P$1 R13.P$1 15,8.82 v14.29,9.53 | R12.P$1 22.47,8.63 22.54,8.71 | R1.P$1 v26.83,30.64 26.83,32.55 C17.P$1 U6.P$5 | J8.P$1 J9.P$1 J10.P$1 7.44,27.05 C25.P$1
  pour PWR (no thermals): 30.8,40.32 30.8,0 0,0 0,40.32
+5V  (via drill 0.35)
  Top 0.254: U2.3 28.83,28.44 C13.P$1 28.01,28.18 v27.94,28.26 | U6.P$1 33.02,32.7 C16.P$1 | U6.P$3 33.02,34.6 C16.P$1 | C16.P$1 R15.P$1 v33.34,35.88
  PWR 0.254: v33.34,35.88 27.94,30.48 | 27.94,30.48 v27.94,28.26 | 24.13,34.29 27.94,30.48
  PWR 0.406: 24.13,34.29 22.7,35.72 J3.P$2 J4.P$2
+24V  (via drill 0.35)
  Top 0.254: U2.10 33.52,27.44 34.29,26.67 v34.29,25.72 C14.P$1
  other vias: 39.21,22.07 40.16,22.07 40.16,23.02 39.21,23.02 39.21,14.13 40.16,14.13 39.21,13.18 40.16,13.18
  pour Top (no thermals): 38.58,7.14 38.58,13.81 38.1,14.33 35.24,14.33 35.24,14.72 41.75,14.72 41.75,7.14
  pour PWR (no thermals): 32.7,40.32 60.33,40.32 60.33,0 32.7,0
  pour Top (no thermals): 40.64,23.5 38.73,23.5 38.73,22.54 38.1,21.87 35.24,21.87 35.24,21.48 40.64,21.48
C6  (via drill 0.35)
  Top 0.254: U4.7 11.23,28.03 v11.43,28.23
  Bottom 0.406: v11.43,28.23 11.43,33.02 J7.P$1
CAN_CS  (via drill 0.35)
  Top 0.254: U2.14 33.15,30.35 32.7,30.8 v30.16,30.8 | v16.51,23.5 15.88,22.86 15.56,22.86 15.24,22.54 15.24,21.91 15.48,21.66 U4.63
  Bottom 0.254: v30.16,30.8 28.89,30.8 24.45,26.35 19.37,26.35 v16.51,23.5
CAN_N
  Top 0.254: CH1.P$3 38.8,28.18 R8.P$2
  Top 0.406: R8.P$2 46.9,28.18 J1.2
CAN_P
  Top 0.254: CH1.P$2 38.8,29.28 R8.P$1
  Top 0.406: R8.P$1 42.5,29.28 J1.4
CAN_RST  (via drill 0.35)
  Top 0.254: U2.5 29.66,27.44 26.35,24.13 20.93,24.13 v20.3,23.5 | U4.62 17.51,21.16 v17.62,21.27
  Bottom 0.254: v17.62,21.27 19.84,23.5 v20.3,23.5
CAN_RX  (via drill 0.35)
  Top 0.254: U2.4 29.37,27.94 28.42,26.99 19.05,26.99 17.14,25.08 v15.24,25.08 | v13.02,21.91 14.26,20.66 U4.61
  Bottom 0.254: v15.24,25.08 13.02,22.86 v13.02,21.91
CAN_TX  (via drill 0.35)
  Top 0.254: U2.1 29.69,29.44 R1.P$2 25.47,27.62 v15.24,27.62 | v11.59,22.54 11.59,17.02 14.23,14.38 U4.48
  Bottom 0.254: v15.24,27.62 11.59,23.97 v11.59,22.54
GND  (via drill 0.35)
  Top 0.152: U5.3 25.17,10.39 v25.08,10.48 | U4.5 12.23,26.43 C15.P$2 v12.86,27.62 | U2.15_16 31.06,27.25 U2.15_8 | U2.15_1 31.06,29.13 U2.15_9 | U2.15_2 31.52,29.17 U2.15_10 | U2.15_4 32.44,29.13 U2.15_11 31.98,29.21 U2.15_3
  Top 0.254: U2.15_9 31,28.94 30.98,28.94 U2.2 28.92,28.94 C13.P$2 | v25.4,23.34 R4.P$2 | C28.P$2 v12.7,9.61 C19.P$2 | Q2.2 v12.22,7.3 | C22.P$2 v18.89,12.22 | C26.P$2 3.09,20.16 U4.21 5.55,20.16 5.71,20 5.71,17.78 5.6,17.66 U4.26 | C26.P$2 1.67,19.21 C18.P$2 v1.67,16.99 C27.P$2 | U4.17 3.75,22.16 2.86,21.27 C26.P$2 | C20.P$2 v19.92,19.84 C24.P$2 | C30.P$2 v2.06,24.61 | U4.45 v12.73,13.7 | U4.58 v15.19,19.16 | C29.P$2 v4.29,10 | v4.29,10 | C25.P$2 v6.51,27.78 | C21.P$2 v18.89,24.61 | v18.89,24.61 | U6.P$2 27.62,33.66 C17.P$2 v26.67,35.24 | D3.CATHODE 36.24,34.02 C16.P$2 v35.88,32.7 | U1.P$29 U1.P$40 | C31.P$2 v20.32,10.64 20.32,11.19 C23.P$2 | U2.15 U2.15_15 | C7.P$2 24.49,19.73 v23.97,19.73
  Top 0.406: U1.P$12 34.3,21.02 U1.P$48 | U1.P$51 34.24,22.32 U1.P$14 37.33,22.32 C3.P$2 | U1.P$3 34.3,15.17 U1.P$33 | C2.P$2 36.05,12.06 U1.P$30
  other vias: 44.61,6.19 46.51,6.19 46.51,9.68 44.61,9.68
  pour Top (no thermals): 43.81,10.48 43.81,5.4 47.31,5.4 47.31,10.48
  pour GND (no thermals): 0,59.69 0,0 60.33,0 60.33,59.69
  pour Bottom (no thermals): 0,40.32 0,0 60.33,0 60.33,40.32
  pour Top (no thermals): 30.64,26.51 30.64,23.02 34.92,23.02 34.92,24.13 34.61,24.45 32.86,24.45 32.54,24.77 32.54,26.51
MCU_SCLK  (via drill 0.35)
  Top 0.254: U1.P$22 26.68,17.77 v26.35,17.44 | v14.29,22.54 13.73,23.1 U4.2 | U2.8 33.15,25.27 v33.18,25.24
  Bottom 0.254: v14.29,22.54 14.29,21.91 18.75,17.44 v26.35,17.44 30.16,21.25 30.16,22.23 v33.18,25.24
MCU_SDI  (via drill 0.35)
  Top 0.254: U1.P$20 v22.84,19.07 19.75,22.16 U4.64 | U2.6 29.96,26.94 29.21,26.19 v29.21,26.04
  Bottom 0.254: v29.21,26.04 26.94,26.04 22.84,21.93 v22.84,19.07
MCU_SDO  (via drill 0.35)
  Top 0.254: U4.57 17.21,18.66 18.1,17.78 24.13,17.78 v24.61,18.26 24.77,18.42 U1.P$21 | U2.11 34.13,27.94 v34.29,27.78
  Bottom 0.254: v34.29,27.78 27.46,20.95 26.49,20.95 24.61,19.07 v24.61,18.26
MOTOR1_A1
  pour Top (no thermals): 35.24,15.63 35.24,16.66 43.81,16.66 43.81,15.63
MOTOR1_A2
  pour Top (no thermals): 35.24,16.93 35.24,17.96 50.48,17.96 50.48,15.35 47.94,15.35 47.94,16.93
MOTOR1_B1
  pour Top (no thermals): 35.24,19.54 35.24,20.56 43.81,20.56 43.81,19.54
MOTOR1_B2
  pour Top (no thermals): 35.24,18.23 35.24,19.26 47.94,19.26 47.94,20.85 50.48,20.85 50.48,18.23
MOTOR1_CPH
  Top 0.406: U1.P$28 28.71,13.87 C4.P$1
MOTOR1_CPL
  Top 0.406: U1.P$27 C4.P$2
MOTOR1_DIR
  Top 0.254: U4.51 26.46,15.66 27.27,16.47 U1.P$24
MOTOR1_DVDD
  Top 0.406: R3.P$1 R2.P$1 28.39,22.32 U1.P$15 30.25,22.45 C5.P$1
MOTOR1_ENABLE
  Top 0.254: U4.50 26.59,15.16 27.25,15.82 U1.P$25
MOTOR1_FAULT
  Top 0.406: U1.P$16 R2.P$2
MOTOR1_SCS
  Top 0.254: U1.P$18 26.78,20.37 26.51,20.64 22.23,20.64 19.68,23.18 17.78,23.18 16.76,24.2 U4.1
MOTOR1_SLEEP
  Top 0.254: U1.P$26 27.24,15.17 26.73,14.66 U4.49
MOTOR1_STEP
  Top 0.254: U1.P$23 27.28,17.12 26.32,16.16 U4.52
MOTOR1_VCP
  Top 0.406: U1.P$1 37.33,13.87 C1.P$2
MOTOR1_VREF
  Top 0.406: U1.P$17 27.32,21.02 R3.P$2 R4.P$1
N$1
  Top 0.254: R15.P$2 36.24,35.52 D3.ANODE
N$4
  Top 0.254: U2.12 34.6,28.44 CH1.P$4
N$5  (via drill 0.35)
  Top 0.406: v24.13,7.46 R12.P$2
  Bottom 0.406: CON3.P$5 v24.13,7.46
N$6
  Top 0.254: R9.P$2 11.75,6.1 Q2.3
N$10  (via drill 0.35)
  Top 0.254: v19.05,1.59 26.35,1.59 28.12,3.36 28.12,6.73 R11.P$2
  Bottom 0.406: CON3.P$13 v19.05,1.59
N$11  (via drill 0.35)
  Top 0.254: R13.P$2 v19.05,10.48
  Bottom 0.254: v19.05,10.48 CON3.P$14
N$12  (via drill 0.35)
  Top 0.254: D1.C v17.78,1.59
  Bottom 0.254: v17.78,1.59 CON3.P$15
N$17
  Top 0.254: U2.13 34.51,28.94 CH1.P$1
N$25
  Top 0.254: U5.2 26.19,9.37 | 26.19,9.37 R14.P$2 | D1.A 26.42,3.56 27.62,4.76 27.62,5.71 26.19,7.14 26.19,9.37
N$27
  Top 0.254: J8.P$2 10.23,26.22 U4.9
N$32
  Top 0.254: U4.11 9.21,24.21 J9.P$2
N$34
  Top 0.254: U4.13 8.23,26.26 J10.P$2
SERVO_SIGNAL  (via drill 0.35)
  Top 0.254: U4.35 7.73,13.76 10.48,16.51 v10.48,22.86 | v10.48,28.26 11.11,28.89 18.1,28.89 21.27,32.07
  Top 0.406: 21.27,32.07 J3.P$1
  Bottom 0.254: v10.48,22.86 v10.48,28.26
TCK  (via drill 0.35)
  Top 0.254: v6.99,8.57 8.23,9.81 U4.36
  Bottom 0.406: v6.99,8.57 9.84,5.71 20,5.71 20.32,5.4 CON3.P$11 CON3.P$9
TDI  (via drill 0.35)
  Top 0.254: v25.4,6.03 17.14,6.03 16.12,5.01 10.32,5.01 9.73,5.6 U4.39
  Bottom 0.406: CON3.P$3 v25.4,6.03
TDO  (via drill 0.35)
  Top 0.254: U4.37 8.73,9.38 v8.09,8.74
  Bottom 0.406: CON3.P$7 22.86,5.4 21.9,6.36 10.47,6.36 v8.09,8.74
TMS  (via drill 0.35)
  Top 0.254: v26.67,5.24 17.3,5.24 16.51,4.45 10.16,4.45 9.21,5.4 9.21,12.61 U4.38
  Bottom 0.406: CON3.P$1 v26.67,5.24
X1
  Top 0.254: U4.42 11.23,8.53 R10.P$2 11.75,8.5 Q2.1
X2
  Top 0.254: U4.41 10.73,8.58 R10.P$1 R9.P$1
XBAR4  (via drill 0.35)
  Top 0.254: U4.32 6.41,14.66 7.62,15.88 v7.62,22.86 | v7.62,28.26 10.16,30.8 11.43,30.8 12.7,32.07
  Top 0.406: 12.7,32.07 J6.P$1
  Bottom 0.254: v7.62,22.86 v7.62,28.26
XBAR7  (via drill 0.35)
  Top 0.254: U4.33 6.73,14.03 8.57,15.88 v8.57,22.86 | v8.57,28.26 10.48,30.16 13.65,30.16 15.56,32.07
  Top 0.406: 15.56,32.07 J5.P$1
  Bottom 0.254: v8.57,22.86 v8.57,28.26
XBAR8  (via drill 0.35)
  Top 0.254: U4.34 7.23,13.89 9.53,16.19 v9.53,22.86 | v9.53,28.26 10.79,29.53 15.88,29.53 18.41,32.07
  Top 0.406: 18.41,32.07 J4.P$1
  Bottom 0.254: v9.53,22.86 v9.53,28.26

### Text on the board
tNames: GND / Sig | GND / 5V / XBAR1 | 1 2 4
bNames: Made for Idaho Outreach / By Shaun Martin of CoolBots